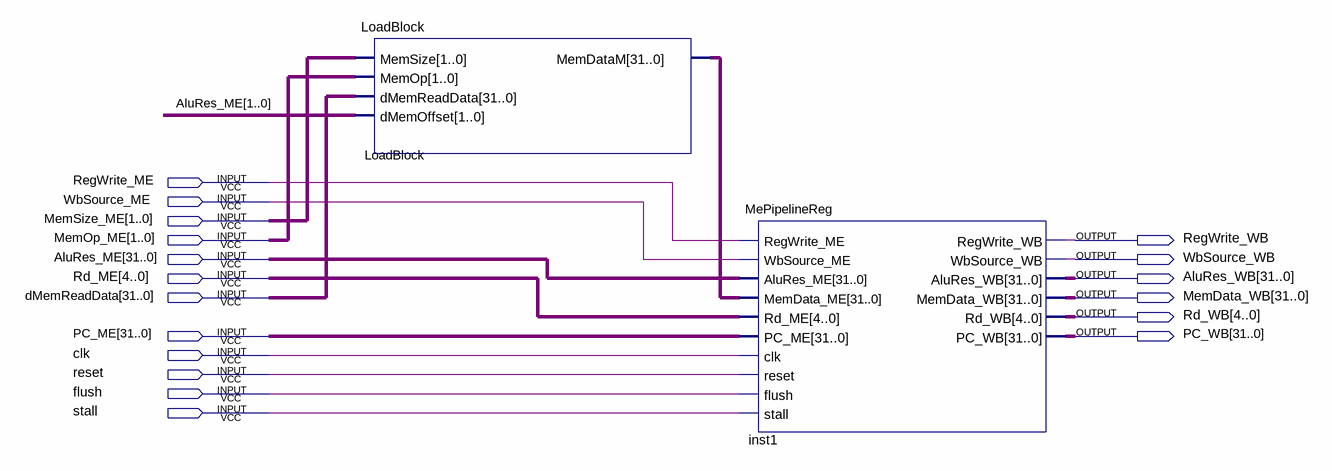
[diagram p0: schematic sheet]
// Quartus schematic Memory.bdf as structural Verilog: 2 symbols, 18 pins
module Memory (
  input  RegWrite_ME,
  input  WbSource_ME,
  input  [1:0] MemSize_ME,
  input  [1:0] MemOp_ME,
  input  [31:0] AluRes_ME,
  input  [4:0] Rd_ME,
  input  [31:0] dMemReadData,
  input  [31:0] PC_ME,
  input  clk,
  input  reset,
  input  flush,
  input  stall,
  output RegWrite_WB,
  output WbSource_WB,
  output [31:0] AluRes_WB,
  output [31:0] MemData_WB,
  output [4:0] Rd_WB,
  output [31:0] PC_WB
);

  wire [31:0] LoadBlock_memdatam;

  LoadBlock LoadBlock (
    .MemSize(MemSize_ME), .MemOp(MemOp_ME), .dMemReadData(dMemReadData), .dMemOffset(AluRes_ME[1:0]),
    .MemDataM(LoadBlock_memdatam));
  MePipelineReg inst1 (
    .RegWrite_ME(RegWrite_ME), .WbSource_ME(WbSource_ME), .AluRes_ME(AluRes_ME),
    .MemData_ME(LoadBlock_memdatam), .Rd_ME(Rd_ME), .PC_ME(PC_ME), .clk(clk), .reset(reset), .flush(flush),
    .stall(stall), .RegWrite_WB(RegWrite_WB), .WbSource_WB(WbSource_WB), .AluRes_WB(AluRes_WB),
    .MemData_WB(MemData_WB), .Rd_WB(Rd_WB), .PC_WB(PC_WB));
endmodule
